# EasyEDA Pro project ProPrj_UNO2FL32x8_COMM_pro_2026-06-11.epro, board UNO2FL32x8_COMM
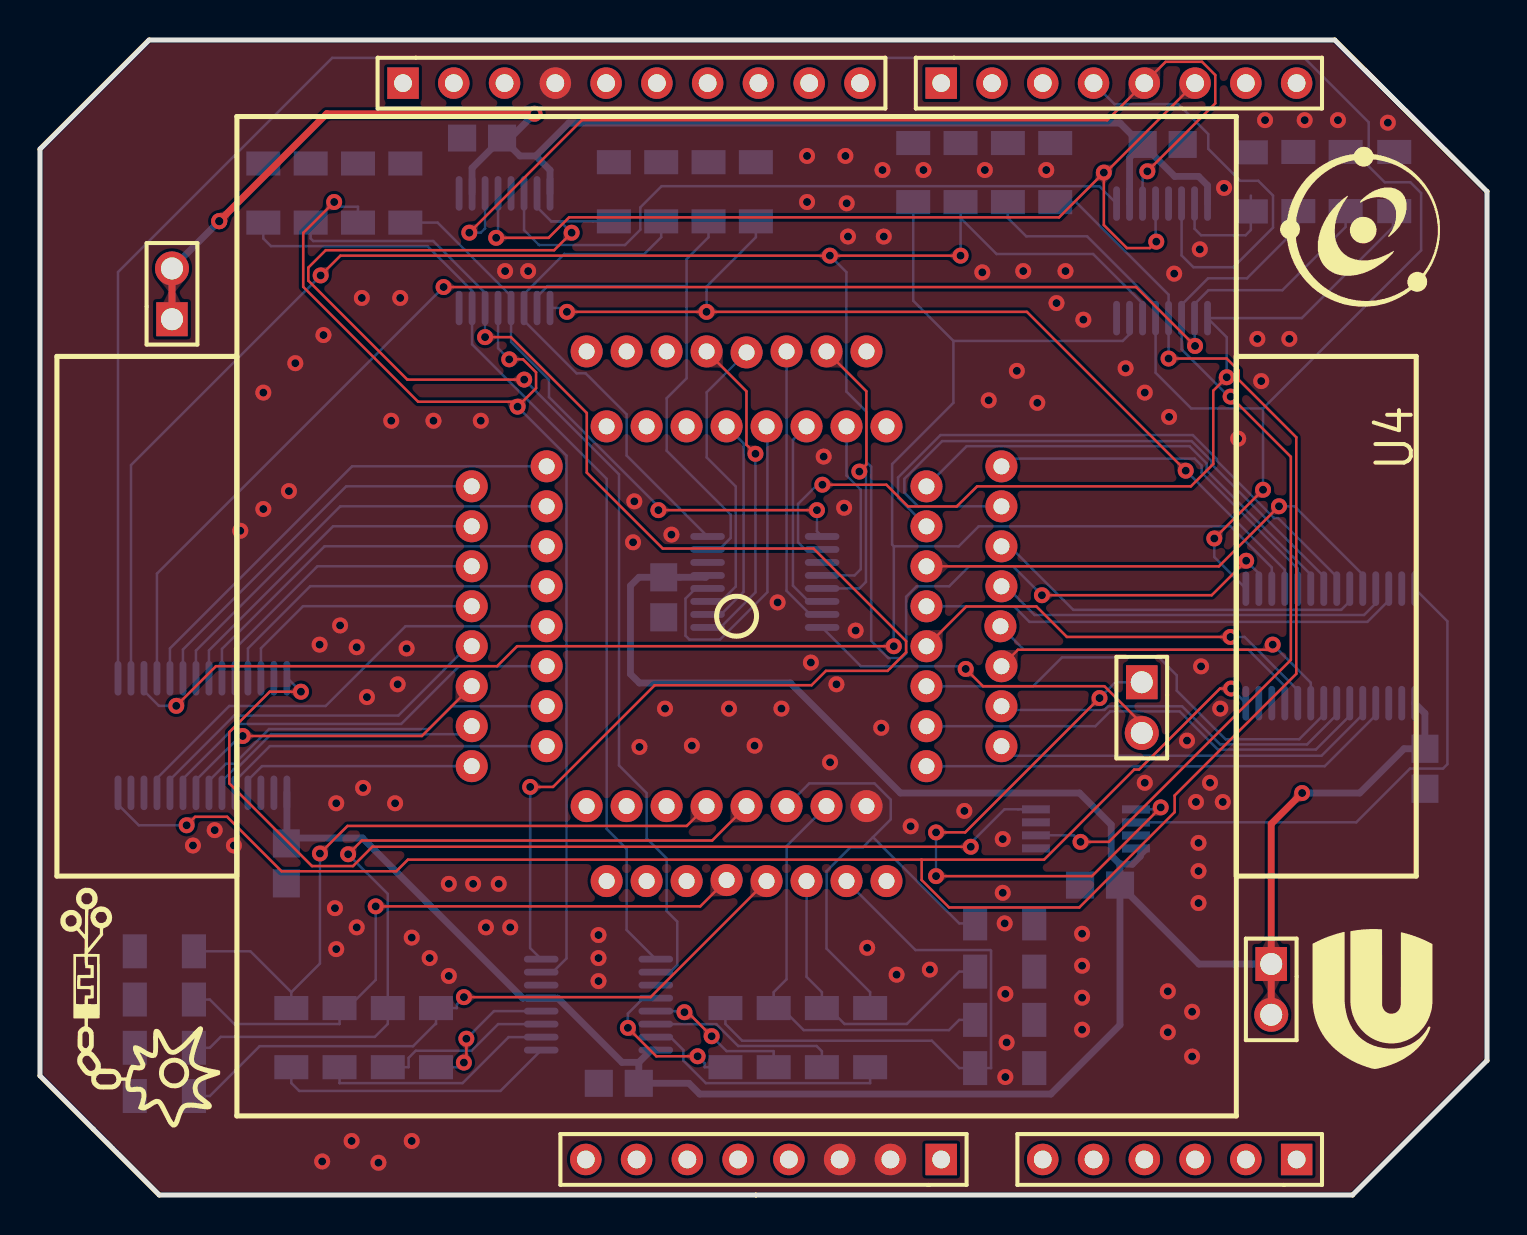
[diagram p2: board, top side]
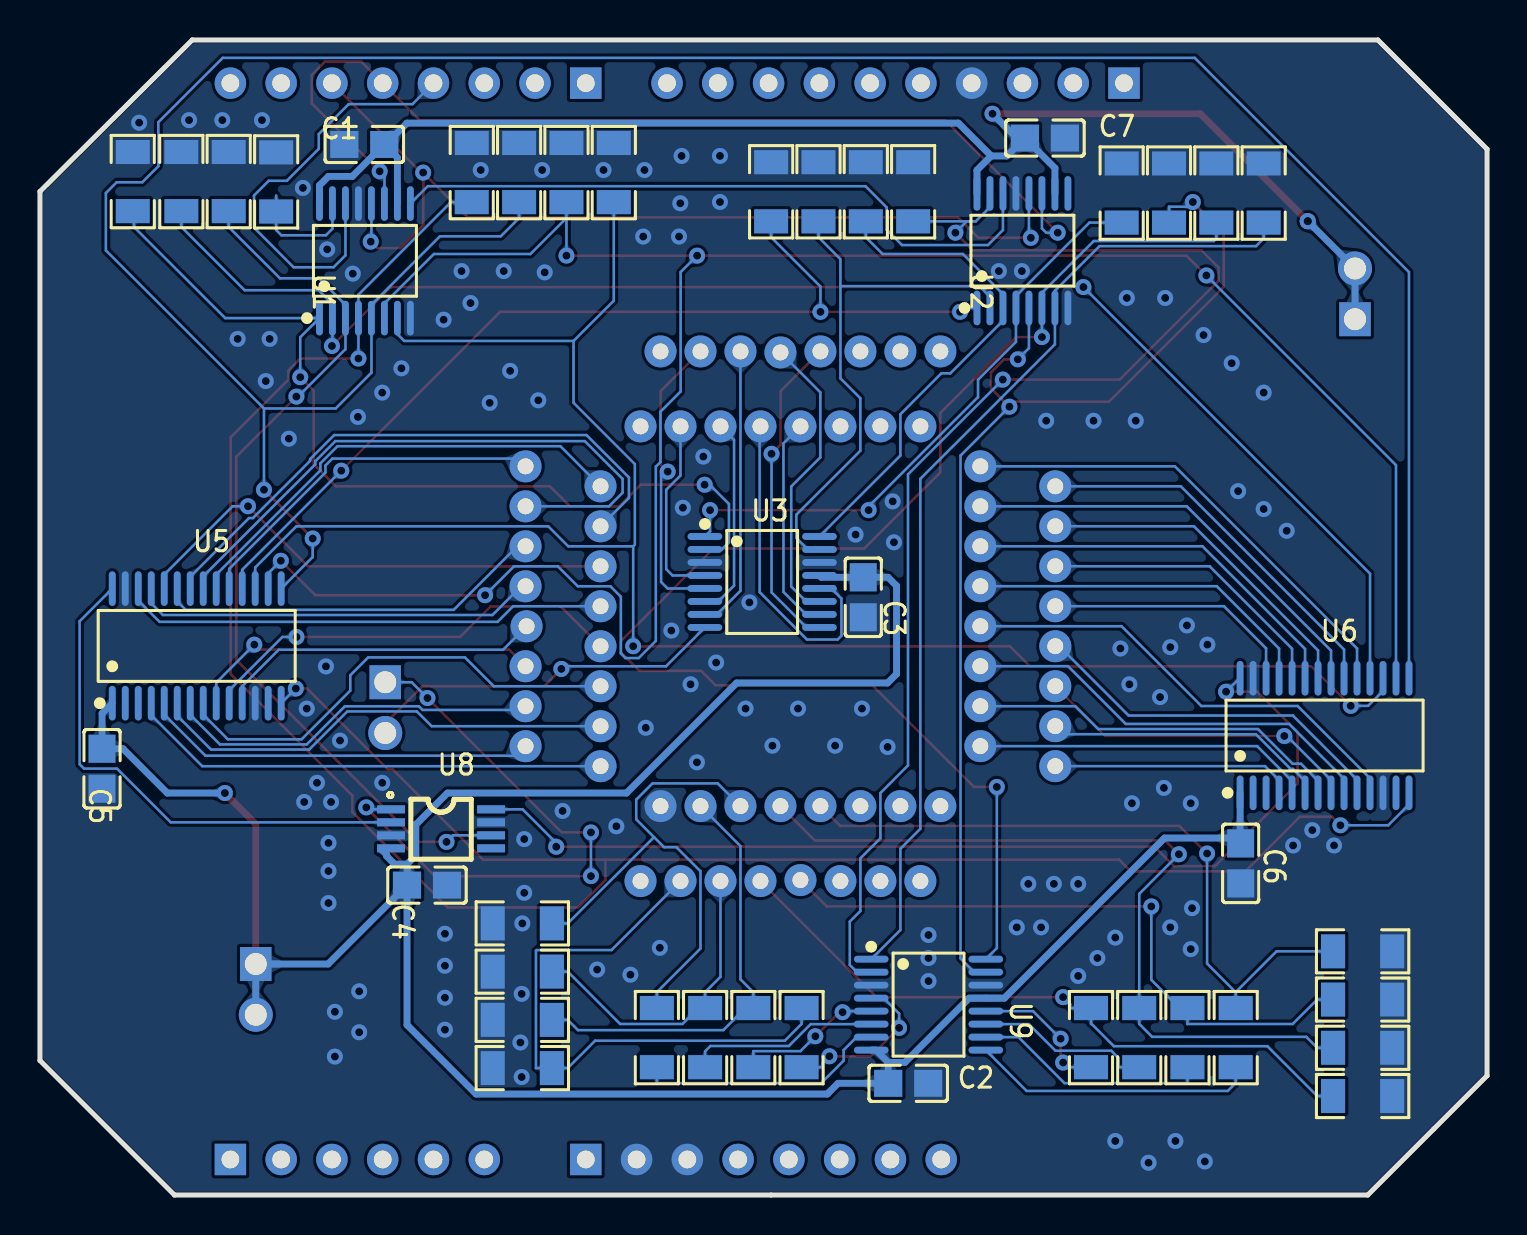
[diagram p3: board, bottom side, seen from below]

Outline 72.39 x 57.78 mm; copper layers: Top Layer, Bottom Layer. Coordinates in mm from the lower left corner of the outline.
Outline path: 0,52.32 0,5.97 5.97,0 65.66,0 72.39,6.73 72.39,50.2 64.77,57.78 5.46,57.78 0,52.32

## Design rules (mm)
spacing Default (default): track to track 0.127, other pairs 0 to 0.127
spacing PWR: track to track 0.201, other pairs 0 to 0.201
track width Default (default): min 0.127, default 0.127, max 25.4
track width PWR: min 0.343, default 0.343, max 25.4
via Default (default): diameter min 0.8, default 0.8, max 100.025; hole min 0.4, default 0.4, max 59.995
via PWR: diameter min 0.8, default 0.8, max 100.025; hole min 0.4, default 0.4, max 59.995
net GND uses PWR
net VCCA uses PWR
net VCCD uses PWR
pour e242 uses gge71250
pour e1171 uses gge71250(1)

## Placement (name value [footprint] x y rotation side)
C1  0.1u  [C0805]  56.16 52.56 0 bottom
C2  0.1u  [C0805]  28.96 5.59 180 bottom
C3  0.1u  [C0805]  31.2 29.9 270 bottom
C4  0.1u  [C0805]  53.03 15.5 180 bottom
C5  0.1u  [C0805]  69.29 21.33 270 bottom
C6  0.1u  [C0805]  12.32 16.59 270 bottom
C7  0.1u  [C0805]  22.12 52.88 180 bottom
J1  HDR-M-2.54_1x10  [HDR-M-2.54_1X10]  29.59 55.63 0 top
J2  HDR-M-2.54_1x8  [HDR-M-2.54_1X8]  34.92 1.78 180 top
J3  HDR-M-2.54_1x8  [HDR-M-2.54_1X8]  55.24 55.63 0 top
J4  HDR-M-2.54_1x6  [HDR-M-2.54_1X6]  56.52 1.78 180 top
J5  HDR-M-2.54_1x2  [HDR-M-2.54_1X2]  6.6 45.08 90 top
J6  HDR-M-2.54_1x2  [HDR-M-2.54_1X2]  61.6 10.29 270 top
J7  HDR-M-2.54_1x2  [HDR-M-2.54_1X2]  55.12 24.38 270 top
R1  50k  [R1206]  11.17 50.13 270 bottom
R2  50k  [R1206]  13.54 50.13 270 bottom
R3  50k  [R1206]  15.91 50.13 270 bottom
R4  50k  [R1206]  35.81 50.19 270 bottom
R5  50k  [R1206]  33.45 50.19 270 bottom
R6  50k  [R1206]  31.08 50.19 270 bottom
R7  50k  [R1206]  28.71 50.19 270 bottom
R8  50k  [R1206]  50.79 51.15 270 bottom
R9  50k  [R1206]  48.42 51.15 270 bottom
R10  50k  [R1206]  46.05 51.15 270 bottom
R11  50k  [R1206]  43.68 51.15 270 bottom
R12  50k  [R1206]  62.95 50.7 270 bottom
R13  50k  [R1206]  65.32 50.7 270 bottom
R14  50k  [R1206]  67.75 50.7 270 bottom
R15  50k  [R1206]  60.58 50.69 270 bottom
R16  50k  [R1206]  18.28 50.13 270 bottom
R17  1.8k  [R1206]  34.29 7.87 270 bottom
R18  1.8k  [R1206]  36.7 7.87 270 bottom
R19  1.8k  [R1206]  39.12 7.87 270 bottom
R20  1.8k  [R1206]  41.53 7.87 270 bottom
R21  1.8k  [R1206]  19.81 7.87 270 bottom
R22  1.8k  [R1206]  17.4 7.87 270 bottom
R23  1.8k  [R1206]  14.99 7.87 270 bottom
R24  1.8k  [R1206]  12.57 7.87 270 bottom
R25  3.3k  [R1206]  48.26 13.59 0 bottom
R26  3.3k  [R1206]  48.26 11.18 0 bottom
R27  3.3k  [R1206]  48.26 6.35 0 bottom
R28  3.3k  [R1206]  48.26 8.76 0 bottom
R29  3.3k  [R1206]  6.22 7.37 180 bottom
R30  3.3k  [R1206]  6.22 4.95 180 bottom
R31  3.3k  [R1206]  6.22 9.78 180 bottom
R32  3.3k  [R1206]  6.22 12.19 180 bottom
U1  74HC595PW,118  [TSSOP-16_L5.0-W4.4-P0.65-LS6.4-BL]  56.13 46.74 180 bottom
U2  74HC595PW,118  [TSSOP-16_L5.0-W4.4-P0.65-LS6.4-BL]  23.24 47.24 180 bottom
U3  ADG708BRUZ-REEL  [TSSOP-16_L5.0-W4.4-P0.65-LS6.4-BL]  36.26 30.67 270 bottom
U4  Crossbar 32*8  [CROSSBARR32*8_NO_SCREW]  34.8 28.96 270 top
U5  ADG706BRUZ  [TSSOP-28_L9.7-W4.4-P0.65-LS6.4-BL]  64.55 27.47 180 bottom
U6  ADG706BRUZ  [TSSOP-28_L9.7-W4.4-P0.65-LS6.4-BL]  8.13 22.99 180 bottom
U8  ADG619BRMZ-REEL7  [MSOP-8_L3.0-W3.0-P0.65-LS4.9-TL]  52.33 18.32 180 bottom
U9  ADG708BRUZ-REEL  [TSSOP-16_L5.0-W4.4-P0.65-LS6.4-BL]  27.94 9.53 270 bottom

## Footprints (pads in the part's own frame, mm; a bottom-side part is the same pattern mirrored in y, then rotated)
C0805
  rect 1.41x1.35 smd: 1(-1,0) 2(1,0)
CROSSBARR32*8_NO_SCREW
  round 1.6 hole 0.8: 1(-7.5,-9.45) 2(-6.5,-13.2) 3(-5.5,-9.45) 4(-4.5,-13.2) 5(-3.5,-9.45) 6(-2.499,-13.2) 7(-1.5,-9.45) 8(-0.499,-13.2) 9(0.5,-9.45) 10(1.5,-13.2) 11(2.5,-9.45) 12(3.501,-13.2) 13(4.5,-9.45) 14(5.5,-13.2) 15(6.5,-9.45) 16(7.5,-13.2) 17(9.5,-7.45) 18(13.25,-6.45) 19(9.5,-5.45) 20(13.25,-4.45) 21(9.5,-3.45) 22(13.25,-2.45) 23(9.5,-1.45) 24(13.2,-0.45) 25(9.5,0.55) 26(13.25,1.55) 27(9.5,2.55) 28(13.25,3.55) 29(9.5,4.55) 30(13.25,5.55) 31(9.5,6.55) 32(13.25,7.55) 33(7.503,9.55) 34(6.503,13.3) 35(5.503,9.55) 36(4.503,13.3) 37(3.502,9.55) 38(2.502,13.3) 39(1.502,9.55) 40(0.502,13.25) 41(-0.497,9.55) 42(-1.498,13.3) 43(-2.498,9.55) 44(-3.498,13.3) 45(-4.497,9.55) 46(-5.497,13.3) 47(-6.497,9.55) 48(-7.497,13.3) 49(-9.498,7.55) 50(-13.248,6.55) 51(-9.498,5.55) 52(-13.248,4.55) 53(-9.498,3.55) 54(-13.248,2.55) 55(-9.498,1.55) 56(-13.198,0.55) 57(-9.498,-0.451) 58(-13.248,-1.45) 59(-9.498,-2.45) 60(-13.248,-3.45) 61(-9.5,-4.45) 62(-13.248,-5.45) 63(-9.498,-6.45) 64(-13.248,-7.45)
HDR-M-2.54_1X2
  rect 1.7x1.575 hole 1.1: 1(-1.27,0)
  round 1.7 hole 1.1: 2(1.27,0)
HDR-M-2.54_1X6
  rect 1.575x1.575 hole 0.889: 1(-6.35,0)
  round 1.575 hole 0.889: 2(-3.81,0) 3(-1.27,0) 4(1.27,0) 5(3.81,0) 6(6.35,0)
HDR-M-2.54_1X8
  rect 1.575x1.575 hole 0.889: 1(-10.16,0)
  round 1.575 hole 0.889: 2(-7.62,0) 3(-5.08,0) 4(-2.54,0) 5(0,0) 6(2.54,0) 7(5.08,0) 8(7.62,0)
HDR-M-2.54_1X10
  rect 1.575x1.575 hole 0.889: 1(-11.43,0)
  round 1.575 hole 0.889: 2(-8.89,0) 3(-6.35,0) 4(-3.81,0) 5(-1.27,0) 6(1.27,0) 7(3.81,0) 8(6.35,0) 9(8.89,0) 10(11.43,0)
MSOP-8_L3.0-W3.0-P0.65-LS4.9-TL
  rect 1.397x0.406 smd: 1(-2.502,0.975) 2(-2.502,0.325) 3(-2.502,-0.325) 4(-2.502,-0.975) 5(2.502,-0.975) 6(2.502,-0.325) 7(2.502,0.325) 8(2.502,0.975)
R1206
  rect 1.208x1.701 smd: 1(-1.479,0) 2(1.479,0)
TSSOP-16_L5.0-W4.4-P0.65-LS6.4-BL
  oval 0.343x1.732 smd: 1(-2.275,-2.866) 2(-1.625,-2.866) 3(-0.975,-2.866) 4(-0.325,-2.866) 5(0.325,-2.866) 6(0.975,-2.866) 7(1.625,-2.866) 8(2.275,-2.866) 9(2.275,2.865) 10(1.625,2.865) 11(0.975,2.865) 12(0.325,2.865) 13(-0.325,2.865) 14(-0.975,2.865) 15(-1.625,2.865) 16(-2.275,2.865)
TSSOP-28_L9.7-W4.4-P0.65-LS6.4-BL
  oval 0.343x1.732 smd: 1(-4.225,-2.866) 2(-3.575,-2.866) 3(-2.925,-2.866) 4(-2.275,-2.866) 5(-1.625,-2.866) 6(-0.975,-2.866) 7(-0.325,-2.866) 8(0.325,-2.866) 9(0.975,-2.866) 10(1.625,-2.866) 11(2.275,-2.866) 12(2.925,-2.866) 13(3.575,-2.866) 14(4.225,-2.866) 15(4.225,2.865) 16(3.575,2.865) 17(2.925,2.865) 18(2.275,2.865) 19(1.625,2.865) 20(0.975,2.865) 21(0.325,2.865) 22(-0.325,2.865) 23(-0.975,2.865) 24(-1.625,2.865) 25(-2.275,2.865) 26(-2.925,2.865) 27(-3.575,2.865) 28(-4.225,2.865)

## Nets
As in the schematic.

Pads without a net: U2 9; U4 17 18 19 20 21 22 32 49 50 59 60 61 62 63 64; U5 2 3 13; U6 2 3 13; U8 5

## Via types
v1: diameter 0.8, hole 0.4, Top Layer to Bottom Layer, 183 vias

## Routing (per net, layer and track width the routed paths; a pad name or vN(x,y) marks a point on that pad's centre or on a via; arc(x,y) is an arc through that point)
GND:
  vias: v1(7.65,17.49) v1(8.74,18.25) v1(9.7,17.49) v1(10.02,33.23) v1(11.17,40.14) v1(11.17,34.32) v1(12.45,35.22) v1(12.77,41.61) v1(13.99,27.53) v1(14.12,1.68) v1(14.18,43.02) v1(14.82,19.6) v1(14.76,14.35) v1(14.82,12.3) v1(15.01,28.5) v1(15.59,2.7) v1(15.85,27.41) v1(15.85,13.39) v1(16.1,44.88) v1(16.17,20.37) v1(16.36,24.91) v1(16.93,1.62) v1(17.57,38.73) v1(17.77,19.6) v1(17.89,25.55) v1(18.02,44.88) v1(18.34,27.34) v1(18.6,12.88) v1(18.6,2.7) v1(19.49,11.86) v1(19.68,38.73) v1(20.45,15.57) v1(20.45,10.96) v1(21.67,15.57) v1(22.05,38.73) v1(22.31,13.39) v1(22.95,15.57) v1(23.27,46.22) v1(23.52,13.39) v1(24.42,46.22) v1(27.94,13.01) v1(27.94,11.86) v1(27.94,10.7) v1(29.73,34.7) v1(29.67,32.66) v1(29.99,22.41) v1(31.27,24.33) v1(31.59,33.04) v1(32.61,22.48) v1(34.47,24.33) v1(35.75,22.48) v1(36.9,29.65) v1(37.09,24.33) v1(38.37,51.98) v1(38.37,49.68) v1(38.57,26.64) v1(39.2,36.94) v1(39.52,21.65) v1(39.85,25.55) v1(40.23,34.38) v1(40.29,51.98) v1(40.36,49.61) v1(40.42,47.95) v1(40.8,28.24) v1(41.38,12.37) v1(42.15,51.28) v1(42.08,23.38) v1(42.21,47.95) v1(42.85,11.02) v1(43.56,18.45) v1(44.2,51.28) v1(44.52,11.28) v1(46.24,19.22) v1(47.14,46.16) v1(47.27,51.28) v1(47.46,39.76) v1(48.17,17.81) v1(48.17,15.12) v1(48.26,13.59) v1(48.29,10.06) v1(48.29,5.9) v1(48.36,7.63) v1(48.87,41.23) v1(49.19,46.22) v1(49.89,39.63) v1(50.34,51.28) v1(50.85,44.62) v1(51.3,46.22) v1(52.13,13.07) v1(52.13,11.47) v1(52.13,9.87) v1(52.13,8.27) v1(52.2,43.79) v1(54.31,41.36) v1(55.27,40.14) v1(55.27,20.62) v1(56.42,10.19) v1(56.42,8.14) v1(56.48,38.93) v1(56.74,46.09) v1(57.38,22.73) v1(57.64,9.17) v1(57.64,6.93) v1(57.83,19.66) v1(58.02,47.31) v1(57.96,17.61) v1(57.96,16.21) v1(57.96,14.61) v1(58.08,26.45) v1(58.53,20.62) v1(59.05,24.33) v1(59.24,50.38) v1(59.17,19.66) v1(59.94,37.84) v1(60.9,42.83) v1(61.09,40.72) v1(61.29,53.78) v1(62.5,42.83) v1(63.27,53.78) v1(64.93,53.78) v1(67.43,53.65)
VCCA: length 135.2
  Top Layer w0.343: v1(63.14,20.11) 61.6,18.56 J6.1 J6.2
  Bottom Layer w0.343: U5.1 69.28,24.09 69.28,22.33 68.24,22.33 66.02,20.11 v1(63.14,20.11) ; 54.03,15.5 54.03,8.51 50.57,5.05 33,5.05 32.47,5.59 C2.1 29.96,6.64 ; 54.03,15.5 57.98,11.56 J6.1 ; 54.03,15.5 54.03,16.55 ; 29.96,6.64 29.12,6.64 25.91,9.85 U9.13 24.14,9.85 16.14,17.86 12.64,17.86 12.32,17.54 ; 29.96,6.64 30.57,7.25 30.8,7.25 ; J6.2 J6.1 ; J6.1 60.43,11.56 ; 12.35,20.12 12.35,18.11 12.32,18.08 12.32,17.54 ; 54.83,17.34 55.36,17.34 ; 54.03,16.55 54.65,16.55 55.04,16.95 55.04,17.03 55.36,17.34 ; 54.03,16.55 53.59,16.99 53.59,18.53 52,20.11 43.05,20.11 37.54,25.62 29.99,25.62 29.54,26.06 29.54,30.48 29.96,30.9 C3.1 33.3,30.9 33.4,31 ; C6.1 12.33,17.55 12.32,17.54
VCCD: length 75.9
  Top Layer w0.343: v1(8.97,48.72) 14.34,54.09 v1(24.74,54.09) ; J5.2 J5.1
  Bottom Layer w0.343: 24.81,51.98 25.52,51.27 U2.16 ; 24.8,51.98 26.45,53.63 54.03,53.63 54.06,53.6 55.1,52.56 55.16,52.56 54.51,51.9 U1.10 ; 24.81,51.98 24.01,51.98 C7.1 ; U1.16 58.41,50.51 57.96,50.96 56.76,50.96 55.17,52.56 ; C7.1 23.53,52.88 v1(24.74,54.09) ; C7.1 21.62,51.38 21.62,50.11 ; J5.1 J5.2 v1(8.97,48.72) 9,48.72
B_0: length 18.5
  Bottom Layer w0.127: 48.1,36.45 48.49,36.84 57.76,36.84 58.11,36.49 58.11,36.14 62.92,31.33 62.92,30.34
B_1: length 23.6
  Bottom Layer w0.127: U4.47 46.36,37.46 57.51,37.46 58.36,36.6 58.36,36.25 63.57,31.04 63.57,30.34
B_2: length 31.1
  Bottom Layer w0.127: 64.22,30.34 64.22,30.95 58.62,36.55 58.62,36.71 57.61,37.72 45.13,37.72 43.24,35.83 43.24,35.14 43.93,34.45 48.1,34.45
B_3: length 29.4
  Bottom Layer w0.127: 44.35,33.45 42.93,34.87 42.93,35.9 45.05,38.02 57.67,38.02 58.88,36.81 58.88,36.73 61.74,33.87 61.94,33.87 64.87,30.93 64.87,30.34
B_4: length 19.6
  Bottom Layer w0.127: 48.1,32.45 48.51,32.45 51.69,29.28 65.1,29.28 65.52,29.71 65.52,30.34
B_5: length 25.2
  Top Layer w0.127: v1(61.98,34.46) 58.98,31.45 U4.43
  Bottom Layer w0.127: 61.98,34.46 62.75,34.46 66.17,31.04 66.17,30.34
B_6: length 20.3
  Bottom Layer w0.127: 66.83,30.34 66.83,29.6 66.24,29.02 49.76,29.02 48.32,30.45 48.1,30.45
B_7: length 24.5
  Bottom Layer w0.127: 44.35,29.45 48.72,29.45 49.5,28.67 66.4,28.67 67.48,29.74 67.48,30.34
B_8: length 16.3
  Bottom Layer w0.127: U5.11 62.27,25.45 60.45,27.28 49.22,27.28 U4.40
B_9: length 21.8
  Top Layer w0.127: U4.39 46.34,29.45 49.85,29.45 51.37,27.92 v1(59.56,27.92)
  Bottom Layer w0.127: v1(59.56,27.92) 60.26,27.92 62.92,25.25 62.92,24.61
B_10: length 17.9
  Top Layer w0.127: 48.1,26.45 48.92,27.28 61.67,27.28 v1(61.67,27.54)
  Bottom Layer w0.127: U5.9 63.57,25.63 v1(61.67,27.54)
B_11: length 23.7
  Bottom Layer w0.127: U5.8 64.22,24.03 62.99,22.8 59.3,22.8 56.87,25.23 56.87,26 55.97,26.9 51.13,26.9 49.69,25.45 U4.37
B_12: length 18.9
  Bottom Layer w0.127: 48.1,24.45 48.28,24.27 53.25,24.27 53.43,24.45 57.14,24.45 59.05,22.54 63.39,22.54 64.87,24.03 U5.7
B_13: length 23.6
  Bottom Layer w0.127: 44.35,23.45 52.8,23.45 53.54,24.2 57.01,24.2 58.92,22.29 63.83,22.29 65.52,23.98 65.52,24.61
B_14: length 19.7
  Bottom Layer w0.127: 48.1,22.45 48.58,21.98 64.11,21.98 66.17,24.04 66.17,24.61
B_15: length 24.1
  Bottom Layer w0.127: U5.4 66.83,24.01 64.27,21.45 U4.33
B_16: length 24.1
  Bottom Layer w0.127: 25.35,36.46 15.61,36.46 6.5,27.35 6.5,25.85
B_17: length 19.3
  Bottom Layer w0.127: 7.15,25.85 7.15,27.29 15.32,35.46 21.6,35.46
B_18: length 21.9
  Bottom Layer w0.127: 7.8,25.85 7.8,27.24 15.02,34.45 25.35,34.45
B_19: length 17.1
  Bottom Layer w0.127: 8.45,25.85 8.45,27.25 14.66,33.46 21.6,33.46
B_20: length 19.8
  Bottom Layer w0.127: 9.1,25.85 9.1,27.32 14.24,32.46 25.35,32.46
B_21: length 15
  Bottom Layer w0.127: 9.75,25.85 9.75,27.33 13.88,31.46 21.6,31.46
B_22: length 17.7
  Bottom Layer w0.127: 10.4,25.85 10.4,27.34 13.52,30.46 25.35,30.46
B_23: length 12.9
  Bottom Layer w0.127: 21.6,29.46 13.16,29.46 11.05,27.35 11.05,25.85
B_24: length 23.4
  Bottom Layer w0.127: 5.85,20.12 5.85,20.85 9.47,24.47 14.29,24.47 18.28,28.46 25.35,28.46
B_25: length 18.5
  Bottom Layer w0.127: 21.6,27.45 21.4,27.45 17.93,23.99 9.71,23.99 6.5,20.78 6.5,20.12
B_26: length 21.2
  Bottom Layer w0.127: 7.15,20.12 7.15,20.82 9.9,23.57 18.07,23.57 20.96,26.46 25.35,26.46
B_27: length 16.4
  Top Layer w0.127: 21.6,25.46 19.11,22.96 v1(10.14,22.96)
  Bottom Layer w0.127: 7.8,20.12 7.8,20.76 10.01,22.96 10.14,22.96
B_28: length 19
  Bottom Layer w0.127: 8.45,20.12 8.45,20.72 9.3,21.57 9.72,21.57 11.46,23.31 19.45,23.31 20.6,24.45 25.35,24.45
B_29: length 14.2
  Bottom Layer w0.127: 21.6,23.45 21.2,23.06 11.56,23.06 9.82,21.32 9.71,21.32 9.1,20.71 9.1,20.12
B_30: length 16.9
  Bottom Layer w0.127: 25.35,22.46 11.5,22.46 9.75,20.71 9.75,20.12
B_31: length 12.1
  Bottom Layer w0.127: 10.4,20.12 10.4,20.75 11.11,21.46 21.6,21.46
DIR: length 29.5
  Top Layer w0.127: v1(44.83,18.14) 46.28,18.14 v1(53,24.86) ; v1(56.07,19.39) 52.63,15.95 v1(44.83,15.95)
  Bottom Layer w0.127: 53,24.86 53.8,25.65 J7.1 ; 54.83,19.29 55.71,19.29 ; v1(44.83,18.14) v1(44.83,15.95) ; v1(56.07,19.39) 55.81,19.39 55.72,19.29
DIR_MUX_1: length 26.2
  Bottom Layer w0.127: 54.83,18.64 65.85,18.64 68.54,21.33 70.19,21.33 70.41,21.55 70.41,28.7 68.77,30.34
DIR_MUX_2: length 51.3
  Top Layer w0.127: v1(46.57,17.42) 16.63,17.42 15.66,16.46 13.61,16.46 9.47,20.59 9.47,23.16 11.5,25.18 v1(13.06,25.18)
  Bottom Layer w0.127: 49.82,19.29 48.24,19.29 46.57,17.61 v1(46.57,17.42) ; 12.35,25.85 12.38,25.85 v1(13.06,25.18)
IN_MUX_0: length 95
  Top Layer w0.127: v1(6.82,24.47) 8.8,26.46 22.87,26.46 23.87,27.46 v1(42.71,27.46)
  Bottom Layer w0.127: 5.2,25.85 5.2,25.22 5.95,24.47 v1(6.82,24.47) ; U1.7 54.51,43.07 54.17,42.73 45.69,42.73 ; 42.71,32.45 45.96,32.45 46.96,33.45 59.57,33.45 61.62,31.39 61.62,30.34 ; R11.2 43.69,48.88 43.68,44.74 45.7,42.73 45.7,39.63 42.63,36.57 42.63,32.54 42.71,32.45 v1(42.71,27.46)
IN_MUX_1: length 116.6
  Top Layer w0.127: v1(14.04,46) 15.03,47 v1(39.52,47) v1(46.05,47) ; v1(60.34,31.73) 58.62,30.01 v1(50.12,30.01)
  Bottom Layer w0.127: 60.34,31.73 60.97,31.1 60.97,30.34 ; 46.05,48.88 v1(46.05,47) ; 46.05,48.88 47.85,47.08 52.68,47.08 55.16,44.6 U1.6 ; 46.05,48.88 R10.2 ; v1(50.12,30.01) 48.68,31.45 46.48,31.45 45.48,30.45 43.85,30.45 43.33,29.93 43.33,27.09 43.1,26.86 42.44,26.86 41.58,27.72 41.58,36.44 41.35,36.66 41.35,39.19 40.34,40.2 40.34,46.17 v1(39.52,47) ; v1(14.04,46) 4.55,36.52 4.55,25.85
IN_MUX_2: length 138.3
  Top Layer w0.127: v1(61.18,35.28) v1(58.75,32.84)
  Bottom Layer w0.127: 61.18,39.35 v1(61.18,35.28) ; 60.33,30.34 58.75,31.91 v1(58.75,32.84) ; R9.2 48.42,48.88 49.34,47.96 52.38,47.96 55.81,44.54 U1.5 55.81,41.14 57.6,39.35 61.18,39.35 69.09,47.26 69.09,50.13 68.55,50.67 67.27,50.67 66.47,51.47 66.47,53.67 63.25,56.89 14.62,56.89 3.9,46.17 3.9,25.85
IN_MUX_3: length 119.4
  Top Layer w0.127: v1(7.34,18.5) 7.76,18.92 9.36,18.92 12.09,16.2 17.83,16.2 18.41,16.78 44.1,16.78 ; v1(59.59,25.34) 59.03,25.34 54.98,21.29 54.74,21.29 50.23,16.78 44.1,16.78 ; 44.1,16.78 44.1,15.76 45.48,14.39 52,14.39 56.76,19.15 56.76,19.99 62.85,26.07 62.85,37.91 59.96,40.79 59.96,41.25 59.37,41.85 v1(56.46,41.85)
  Bottom Layer w0.127: U5.14 v1(59.59,25.34) ; R8.2 51.83,49.67 56.46,45.04 U1.4 v1(56.46,41.85) ; 7.34,18.5 4.94,18.5 3.9,19.53 3.9,20.12
IN_MUX_EN_1: length 48.7
  Top Layer w0.127: v1(57.32,36.24) 49.37,44.18 v1(33.35,44.18) v1(26.36,44.18)
  Bottom Layer w0.127: v1(33.35,44.18) 33.35,45.45 35.81,47.92 R4.2 ; U2.1 26.17,44.38 26.36,44.18 ; 57.32,36.24 62.27,31.28 62.27,30.34
IN_MUX_EN_2: length 76.4
  Top Layer w0.127: v1(57.78,42.48) 54.84,45.42 v1(20.19,45.42)
  Bottom Layer w0.127: 20.19,45.43 5.85,31.09 5.85,25.85 ; v1(57.79,42.48) 57.76,42.5 U1.2 57.76,44.57 58.45,45.27 62.15,45.27 65.32,48.43 65.32,49.22
OUT_MUX_0: length 29.9
  Top Layer w0.127: v1(38.87,34.26) v1(30.94,34.26)
  Bottom Layer w0.127: 39.13,32.95 38.87,33.21 38.87,34.26 ; 30.94,34.26 30.94,34.44 25.46,39.92 25.46,40.78 23.57,42.68 U2.4 23.57,44.97 19.89,48.65 18.28,48.65
OUT_MUX_1: length 25
  Bottom Layer w0.127: 33.4,32.95 29.35,37 29.35,39.06 27.3,41.11 26.85,41.11 24.22,43.74 U2.3 24.22,45.07 26.22,47.08 30.24,47.08 31.08,47.92 R6.2
OUT_MUX_2: length 27.7
  Bottom Layer w0.127: 24.87,44.38 24.87,44.94 25.39,45.47 32.35,45.47 32.35,40.86 31.35,39.86 31.35,37.23 34.55,34.03 34.55,32.87 33.98,32.3 33.4,32.3 ; R5.2 33.44,47.92 32.35,46.82 32.35,45.47
OUT_MUX_EN: length 45.7
  Top Layer w0.127: v1(59.37,40.91) 58.69,40.24 58.69,36.57 57.58,35.45 46.88,35.45 45.93,34.51 45.86,34.45 43.43,34.45 42.34,35.53 v1(39.14,35.53)
  Bottom Layer w0.127: 67.69,49.22 67.69,48.43 63.12,43.87 U1.1 59.37,42.91 59.37,40.91 ; 39.13,32.3 38.28,32.3 37.92,32.65 37.92,34.57 38.89,35.53 v1(39.14,35.53)
REG_D: length 21.6
  Bottom Layer w0.127: U1.14 57.11,47.01 57.7,46.42 59.7,46.42 61.68,48.4 61.68,50 60.95,50.74 60.04,50.74 58.44,52.34 58.44,53.08 56.94,54.57 53.76,54.57 J3.4
REG_LC: length 48.2
  Top Layer w0.127: v1(22.82,47.89) 25.45,47.89 26.47,48.91 50.98,48.91 v1(53.22,51.15) ; v1(53.22,51.15) 53.31,51.15 J3.6 ; v1(53.22,51.15) 53.22,48.53 54.37,47.38 55.52,47.38 v1(55.85,47.69)
  Bottom Layer w0.127: v1(22.82,47.89) 22.92,47.98 U2.12 ; v1(55.84,47.7) 55.81,47.73 U1.12
REG_SC: length 51.7
  Top Layer w0.127: v1(21.48,48.14) 27.11,53.77 53.39,53.77 J3.5 56.31,56.69 58.13,56.69 58.79,56.03 58.79,54.61 v1(55.4,51.22)
  Bottom Layer w0.127: v1(21.48,48.14) 22.05,48.14 22.27,48.36 U2.11 ; U1.11 55.16,50.98 v1(55.4,51.21)
REV: length 18.5
  Top Layer w0.127: v1(46.31,26.32) 47.17,25.45 53.25,25.45 55.12,23.59 J7.2
  Bottom Layer w0.127: 39.13,28.39 41.07,26.45 46.17,26.45 v1(46.31,26.32)
SPDT: length 45
  Top Layer w0.127: v1(59.56,39.94) 62.58,36.93 62.58,26.77 53.47,17.67 v1(52.05,17.67)
  Bottom Layer w0.127: R12.2 62.95,48.43 60.38,45.86 58.43,45.86 57.11,44.54 U1.3 57.11,42.31 59.48,39.94 59.56,39.94 ; 52.05,17.67 51.73,17.99 49.82,17.99
U1_9: length 34
  Bottom Layer w0.127: 53.86,49.6 52.99,50.47 31.09,50.47 30.03,49.41 30.03,48.29 29.27,47.53 24.97,47.53 24.22,48.27 U2.14
U1_15: length 6
  Bottom Layer w0.127: U1.15 57.76,48.34 58.08,48.01 60.31,48.01 60.57,48.28 60.57,50
U4_23: length 34.4
  Top Layer w0.127: U4.23 32.36,18.46 15.38,18.46 v1(14,17.08)
  Bottom Layer w0.127: 12.57,10.15 10.53,12.19 R32.1 ; 12.57,10.15 R24.1 ; 12.57,10.15 14,11.58 v1(14,17.08)
U4_24: length 32.9
  Top Layer w0.127: U4.24 33.03,14.44 v1(16.8,14.44)
  Bottom Layer w0.127: 14.98,8.56 14.99,8.56 ; 14.99,8.56 14.99,8.96 ; 14.98,8.56 9.72,8.56 8.5,9.78 R31.1 ; 14.99,8.96 R23.1 ; 14.99,8.96 16.79,10.76 16.79,14.44
U4_25: length 40.4
  Top Layer w0.127: U4.25 33.63,17.74 16.1,17.74 v1(15.42,17.05)
  Bottom Layer w0.127: R29.1 8.5,7.37 9.04,7.91 16.75,7.91 17.4,8.56 ; 17.4,8.56 R22.1 17.4,15.06 v1(15.42,17.05)
U4_26: length 33.7
  Top Layer w0.127: v1(21.21,9.9) 30.54,9.9 U4.26
  Bottom Layer w0.127: 19.81,8.56 19.78,8.56 18.66,7.45 10.99,7.45 8.5,4.95 R30.1 ; 19.81,8.56 R21.1 20.85,9.35 20.85,9.55 v1(21.21,9.9)
U4_27: length 25.9
  Bottom Layer w0.127: R20.1 41.53,10.15 39.35,12.33 39.35,16.2 40.55,17.4 41.17,17.4 41.67,17.9 ; U4.27 38.49,20.59 41.75,20.59 42.56,19.78 42.56,18.79 41.67,17.9 ; 41.67,17.9 45.99,13.59 R25.1
U4_28: length 15.9
  Bottom Layer w0.127: 39.12,9.69 39.12,10.15 38.35,10.92 U4.28 ; 39.12,9.69 40.25,8.56 43.37,8.56 45.99,11.18 R26.1 ; 39.12,9.69 R19.1
U4_29: length 22.1
  Bottom Layer w0.127: U4.29 37.35,17.46 37.35,10.79 36.7,10.15 36.7,9.75 ; R18.1 36.7,9.75 ; 36.7,9.75 38.2,8.25 45.47,8.25 45.99,8.76 R28.1
U4_30: length 29.5
  Bottom Layer w0.127: 34.29,8.56 35.13,7.72 44.62,7.72 45.99,6.35 R27.1 47.58,6.35 ; 47.58,6.35 47.58,6.35 ; 47.58,6.35 47.58,12.22 47.54,12.25 43.8,12.25 U4.30 ; R17.1 34.29,8.56
U4_51: length 9.5
  Bottom Layer w0.127: 40.35,38.45 40.35,35.99 41.06,35.28 41.06,31.31 40.75,31 39.13,31
U4_52: length 15.2
  Top Layer w0.127: v1(40.99,36.19) 41.34,36.54 41.34,40.21 U4.52
  Bottom Layer w0.127: 39.13,30.35 40.99,30.35 41.32,30.67 41.32,36.19 40.99,36.19
U4_53: length 10
  Bottom Layer w0.127: 38.35,38.45 37.67,37.78 37.67,30.48 38.46,29.69 39.13,29.69
U4_54: length 14.2
  Bottom Layer w0.127: 39.13,29.05 38.53,29.05 37.35,30.23 37.35,42.2
U4_55: length 16.6
  Bottom Layer w0.127: 36.35,38.45 36.39,38.41 36.39,30.16 34.02,27.79 32.48,27.79 32.29,27.98 32.29,29.84 32.8,30.35 33.4,30.35
U4_56: length 14.9
  Bottom Layer w0.127: U4.56 33.35,40.16 33.35,36.9 34.81,35.45 34.81,30.44 34.06,29.69 33.4,29.69
U4_57: length 10.9
  Bottom Layer w0.127: 33.4,29.05 34.07,29.05 35.2,30.17 35.2,37.6 34.35,38.45
U4_58: length 16.2
  Top Layer w0.127: v1(35.79,37.08) 35.34,37.53 35.34,40.21 U4.58
  Bottom Layer w0.127: 35.79,37.08 35.79,30.15 34.04,28.39 33.4,28.39
U9_4: length 8.2
  Top Layer w0.127: v1(32.9,6.94) 30.83,6.94 v1(29.41,8.36)
  Bottom Layer w0.127: v1(32.9,6.94) 33.25,6.59 33.25,6.4 R17.2 ; 30.8,9.85 30.19,9.85 29.41,9.08 29.41,8.36
U9_5: length 7.5
  Top Layer w0.127: v1(33.6,7.94) 32.4,9.15 v1(32.24,9.15)
  Bottom Layer w0.127: 30.8,9.2 32.18,9.2 32.24,9.15 ; v1(33.6,7.94) 34.35,7.2 36.69,7.2 36.7,7.19 ; R18.2 36.7,7.19
U9_6: length 9.7
  Bottom Layer w0.127: R19.2 39.12,7.19 38.85,7.46 34.93,7.46 33.83,8.55 30.8,8.55
U9_7: length 12.8
  Bottom Layer w0.127: 30.8,7.9 31.54,7.9 32.19,7.25 32.19,6.72 33.31,5.6 41.53,5.6 41.53,5.6 R20.2
U9_9: length 14.3
  Bottom Layer w0.127: R24.2 12.57,5.6 12.97,5.21 23.03,5.21 25.08,7.25
U9_10: length 11.8
  Bottom Layer w0.127: U9.10 23.44,7.9 21.14,5.6 14.99,5.6 14.99,5.6 R23.2
U9_11: length 8.8
  Bottom Layer w0.127: 25.08,8.55 22.92,8.55 21.58,7.22 18.8,7.22 18.44,6.86 18.44,6.4 R22.2
U9_12: length 7.1
  Top Layer w0.127: v1(21.21,6.63) 21.33,6.75 v1(21.33,7.82)
  Bottom Layer w0.127: 25.08,9.2 22.71,9.2 21.33,7.82 ; v1(21.21,6.63) 21.08,6.63 20.85,6.4 R21.2
WL_MUX_0: length 49.6
  Bottom Layer w0.127: 11.17,48.65 11.17,47.85 11.56,47.47 19.39,47.47 21.62,45.24 21.62,42.56 28.35,35.83 28.35,18.32 29.35,17.32 29.35,13.26 30.8,11.8
WL_MUX_1: length 73
  Top Layer w0.127: v1(22.27,42.92) 23.56,42.92 27.36,39.12 27.36,36.14 31.15,32.34 38.7,32.34 43.33,27.71 43.33,27.15 42.4,26.22 39.32,26.22 38.6,25.5 30.75,25.5 25.67,20.42 v1(24.52,20.42)
  Bottom Layer w0.127: U9.16 24.52,12.35 24.52,20.42 ; 13.54,48.65 13.54,47.85 13.67,47.73 19.67,47.73 22.27,45.13 U2.6 22.27,42.92
WL_MUX_2: length 56.9
  Top Layer w0.127: 23.89,39.69 18.92,39.69 13.17,45.44 13.17,48.13 v1(14.72,49.68) ; 23.89,39.69 24.14,39.69 24.82,40.36 24.82,41.16 24.16,41.81 v1(23.47,41.81) ; 23.89,39.69 v1(23.89,39.44)
  Bottom Layer w0.127: v1(14.72,49.68) 14.95,49.44 15.91,49.44 15.91,48.65 ; U9.15 25.65,11.15 26.34,11.84 26.34,36.99 23.89,39.44 ; U2.5 22.92,42.37 23.47,41.81
WL_MUX_EN: length 67.2
  Top Layer w0.127: v1(26.6,48.14) 25.72,47.27 14.3,47.27 13.42,46.4 13.42,45.75 18.38,40.79 24.22,40.79
  Bottom Layer w0.127: 25.58,48.71 27.67,48.71 ; 25.58,48.71 24.87,49.42 24.87,50.11 ; 25.58,48.71 26.03,48.71 v1(26.6,48.14) ; 27.67,48.71 R7.2 ; 30.8,11.15 31.52,11.15 31.88,11.51 31.88,13.68 31.35,14.21 31.35,16.84 30.35,17.84 30.35,20.11 28.97,21.49 28.97,36.05 24.22,40.8
  vias: v1(24.22,40.79)

## Copper pours and planes (outline as drawn; the poured copper is in the pictures)
GND on Top Layer: -11.36,61.2 -11.36,-6.26 -7.19,-10.42 76.07,-10.42 79.01,-7.47 79.01,60.88 77.29,62.61
GND on Bottom Layer: -11.48,61.2 -11.48,-6.26 -7.32,-10.42 75.94,-10.42 78.89,-7.47 78.89,60.88 77.16,62.61

Small or netless copper shapes (teardrops, artwork), in the pictures only: 86 on Top Layer, 280 on Bottom Layer
